# EAGLE design output_selector_v3 (EAGLE 7.5.0)
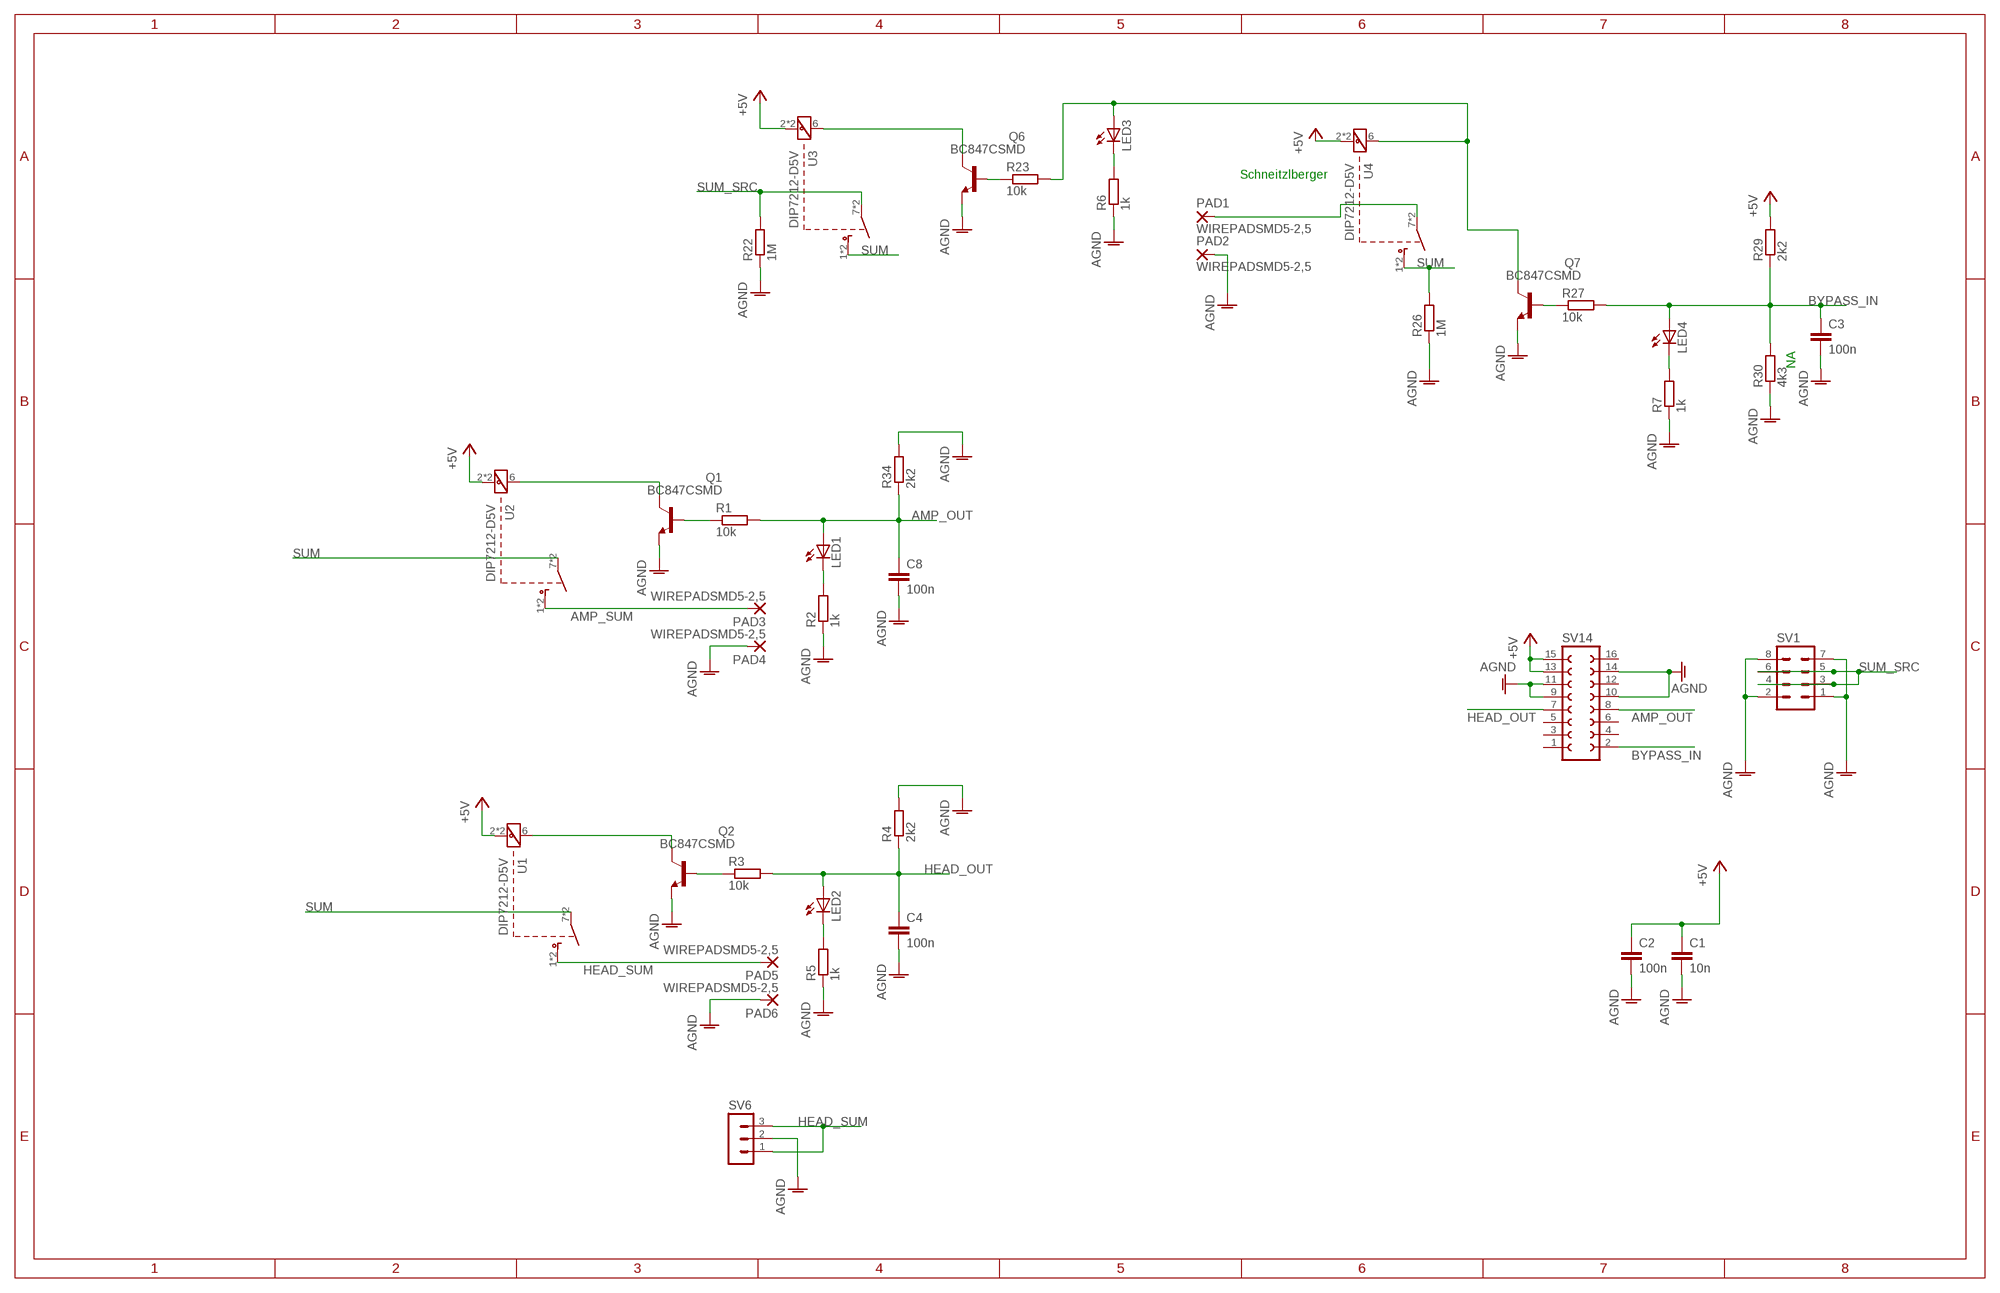
[diagram p0: schematic, sheet 1]

## Parts
C1  10n  C-EUC0603  [C0603]
C2  100n  C-EUC0603  [C0603]
C3  100n  C-EUC0603  [C0603]
C4  100n  C-EUC0603  [C0603]
C8  100n  C-EUC0603  [C0603]
LED1  LEDCHIPLED_0603  [CHIPLED_0603]
LED2  LEDCHIPLED_0603  [CHIPLED_0603]
LED3  LEDCHIPLED_0603  [CHIPLED_0603]
LED4  LEDCHIPLED_0603  [CHIPLED_0603]
PAD1  WIREPADSMD5-2,5  [5-2,5]
PAD2  WIREPADSMD5-2,5  [5-2,5]
PAD3  WIREPADSMD5-2,5  [5-2,5]
PAD4  WIREPADSMD5-2,5  [5-2,5]
PAD5  WIREPADSMD5-2,5  [5-2,5]
PAD6  WIREPADSMD5-2,5  [5-2,5]
Q1  BC847CSMD  [SOT23]
Q2  BC847CSMD  [SOT23]
Q6  BC847CSMD  [SOT23]
Q7  BC847CSMD  [SOT23]
R1  10k  R-EU_R0603  [R0603]
R2  1k  R-EU_R0603  [R0603]
R3  10k  R-EU_R0603  [R0603]
R4  2k2  R-EU_R0603  [R0603]
R5  1k  R-EU_R0603  [R0603]
R6  1k  R-EU_R0603  [R0603]
R7  1k  R-EU_R0603  [R0603]
R22  1M  R-EU_R0603  [R0603]
R23  10k  R-EU_R0603  [R0603]
R26  1M  R-EU_R0603  [R0603]
R27  10k  R-EU_R0603  [R0603]
R29  2k2  R-EU_R0603  [R0603]
R30  4k3  R-EU_R0603  [R0603]
R34  2k2  R-EU_R0603  [R0603]
SV1  MA04-2W  [MA04-2W]
SV6  MA03-1  [MA03-1]
SV14  FE08-2W  [FE08-2W]
U1  DIP7212-D5V  [DP-07]
U2  DIP7212-D5V  [DP-07]
U3  DIP7212-D5V  [DP-07]
U4  DIP7212-D5V  [DP-07]

## Nets
+5V: C1.1 C2.1 R29.2 SV14.13 SV14.15 U1.2 U1.13 U2.2 U2.13 U3.2 U3.13 U4.2 U4.13
AGND: C1.2 C2.2 C3.2 C4.2 C8.2 PAD2.1(P) PAD4.1(P) PAD6.1(P) Q1.2(E) Q2.2(E) Q6.2(E) Q7.2(E) R2.1 R4.2 R5.1 R6.1 R7.1 R22.1 R26.1 R30.1 R34.2 SV1.1 SV1.2 SV1.7 SV1.8 SV6.2 SV14.9 SV14.10 SV14.11 SV14.14
AMP_OUT: C8.1 LED1.A R1.2 R34.1 SV14.8
AMP_SUM: PAD3.1(P) U2.1 U2.14
BYPASS_IN: C3.1 LED4.A R27.2 R29.1 R30.2 SV14.2
HEAD_OUT: C4.1 LED2.A R3.2 R4.1 SV14.7
HEAD_SUM: PAD5.1(P) SV6.1 SV6.3 U1.1 U1.14
N$1: LED3.A Q7.3(C) R23.2 U4.6
N$2: Q1.3(C) U2.6
N$3: Q1.1(B) R1.1
N$4: Q2.3(C) U1.6
N$5: Q2.1(B) R3.1
N$6: LED1.C R2.2
N$7: LED2.C R5.2
N$8: LED3.C R6.2
N$9: LED4.C R7.2
N$23: Q6.1(B) R23.1
N$24: Q6.3(C) U3.6
N$25: PAD1.1(P) U4.7 U4.8
N$27: Q7.1(B) R27.1
SUM: R26.2 U1.7 U1.8 U2.7 U2.8 U3.1 U3.14 U4.1 U4.14
SUM_SRC: R22.2 SV1.3 SV1.4 SV1.5 SV1.6 U3.7 U3.8
Unconnected: SV14.1 SV14.3 SV14.4 SV14.5 SV14.6 SV14.12 SV14.16

## Notes on the sheet
- Schneitzlberger
- NA

## Library data of the parts
C1-C4 C8 = rcl:C-EU: CAPACITOR, European symbol
LED1-LED4 = led:LED: LED OSRAM: - CHIPLED LG R971, LG N971, LY N971, LG Q971, LY Q971, LO R971, LY R971 LH N974, LH R974 LS Q976, LO Q976, LY Q976 LO Q996 - Hyper CHIPLED LW Q18S LB Q993, LB Q99A, LB R99A - SideLED LS A670, LO A670, LY A670, LG A670, LP A670 LB A673, LV A673, LT A673, LW A673 LH A674 LY A675 LS A676, LA A676, LO A676, LY A676, LW A676 LS A679, LY A679, LG A679 - Hyper Micro SIDELED® LS Y876, LA Y876, LO Y876, LY Y876 LT Y87S - SmartLED LW L88C, LW L88S LB L89C, LB L89S, LG L890 LS L89K, LO L89K, LY L89K LS L896, LA L896, LO L896, LY L896 - TOPLED LS T670, LO T670, LY T670, LG T670, LP T670 LSG T670, LSP T670, LSY T670, LOP T670, LYG T670 LG T671, LOG T671, LSG T671 LB T673, LV T673, LT T673, LW T673 LH T674 LS T676, LA T676, LO T676, LY T676, LB T676, LH T676, LSB T676, LW T676 LB T67C, LV T67C, LT T67C, LS T67K, LO T67K, LY T67K, LW E67C LS E67B, LA E67B, LO E67B, LY E67B, LB E67C, LV E67C, LT E67C LW T67C LS T679, LY T679, LG T679 LS T770, LO T770, LY T770, LG T770, LP T770 LB T773, LV T773, LT T773, LW T773 LH T774 LS E675, LA E675, LY E675, LS T675 LS T776, LA T776, LO T776, LY T776, LB T776 LHGB T686 LT T68C, LB T68C - Hyper Mini TOPLED® LB M676 - Mini TOPLED Santana® LG M470 LS M47K, LO M47K, LY M47K Source: http://www.osram.convergy.de LUXEON: - LUMILED® LXK2-PW12-R00, LXK2-PW12-S00, LXK2-PW14-U00, LXK2-PW14-V00 LXK2-PM12-R00, LXK2-PM12-S00, LXK2-PM14-U00 LXK2-PE12-Q00, LXK2-PE12-R00, LXK2-PE12-S00, LXK2-PE14-T00, LXK2-PE14-U00 LXK2-PB12-K00, LXK2-PB12-L00, LXK2-PB12-M00, LXK2-PB14-N00, LXK2-PB14-P00, LXK2-PB14-Q00 LXK2-PR12-L00, LXK2-PR12-M00, LXK2-PR14-Q00, LXK2-PR14-R00 LXK2-PD12-Q00, LXK2-PD12-R00, LXK2-PD12-S00 LXK2-PH12-R00, LXK2-PH12-S00 LXK2-PL12-P00, LXK2-PL12-Q00, LXK2-PL12-R00 Source: www.luxeon.com KINGBRIGHT: KA-3528ASYC Source: www.kingbright.com
PAD1-PAD6 = wirepad:WIREPAD: Wire PAD connect wire on PCB
Q1 Q2 Q6 Q7 = transistor-npn:BC847*: NPN Transistor
R1-R7 R22 R23 R26 R27 R29 R30 R34 = rcl:R-EU_: RESISTOR, European symbol
SV1 = con-lstb:MA04-2W
SV6 = con-lstb:MA03-1: PIN HEADER; OC_FARNELL: unknown; OC_NEWARK: unknown
SV14 = con-lsta:FE08-2W: FEMALE HEADER; OC_FARNELL: unknown; OC_NEWARK: unknown
U1-U4 = meder:DIP7212-D5V: Meder DIP 7212-D 5V Reedrelais, 5V, 1 Schließer mit Diode, 1A http://cdn-reichelt.de/documents/datenblatt/C300/DATASHEET_DIP_NEW.pdf

## Board
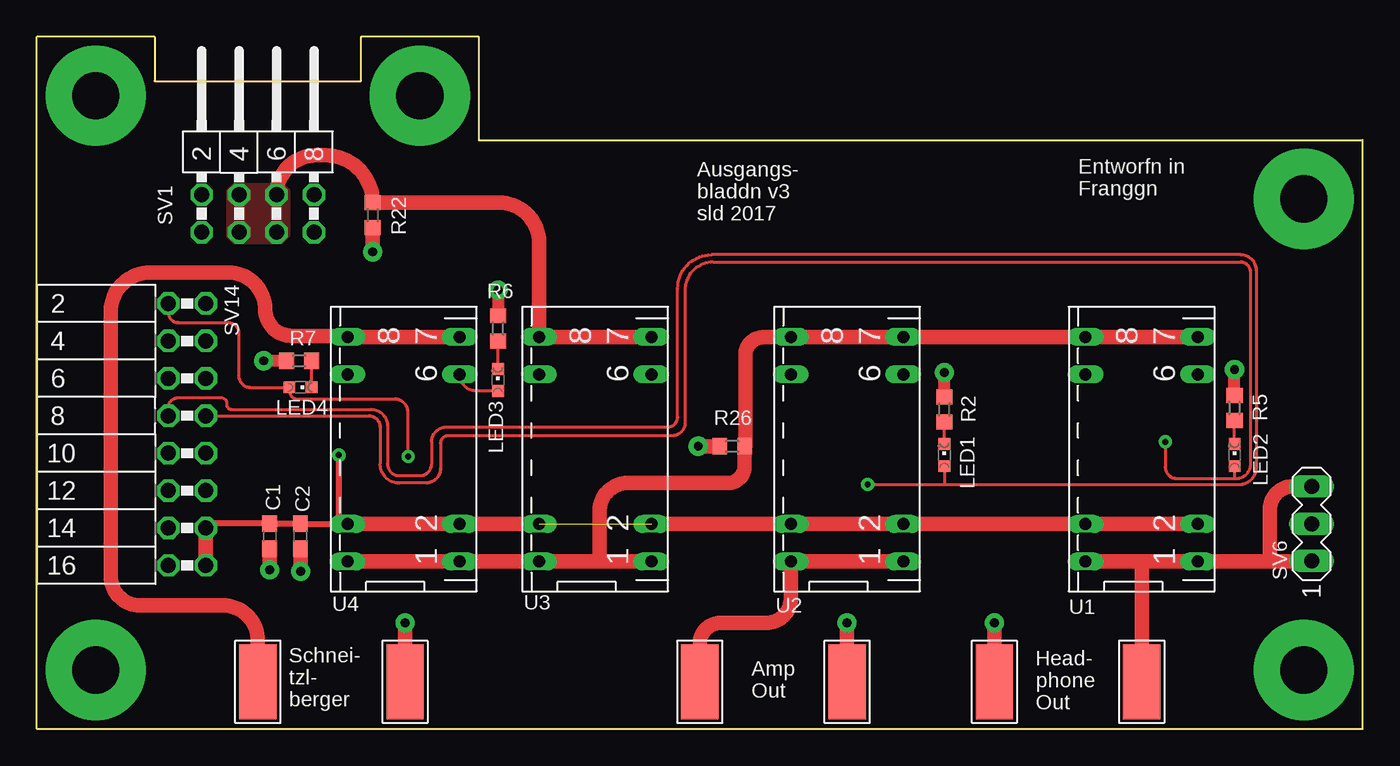
[diagram p1: board, top side]
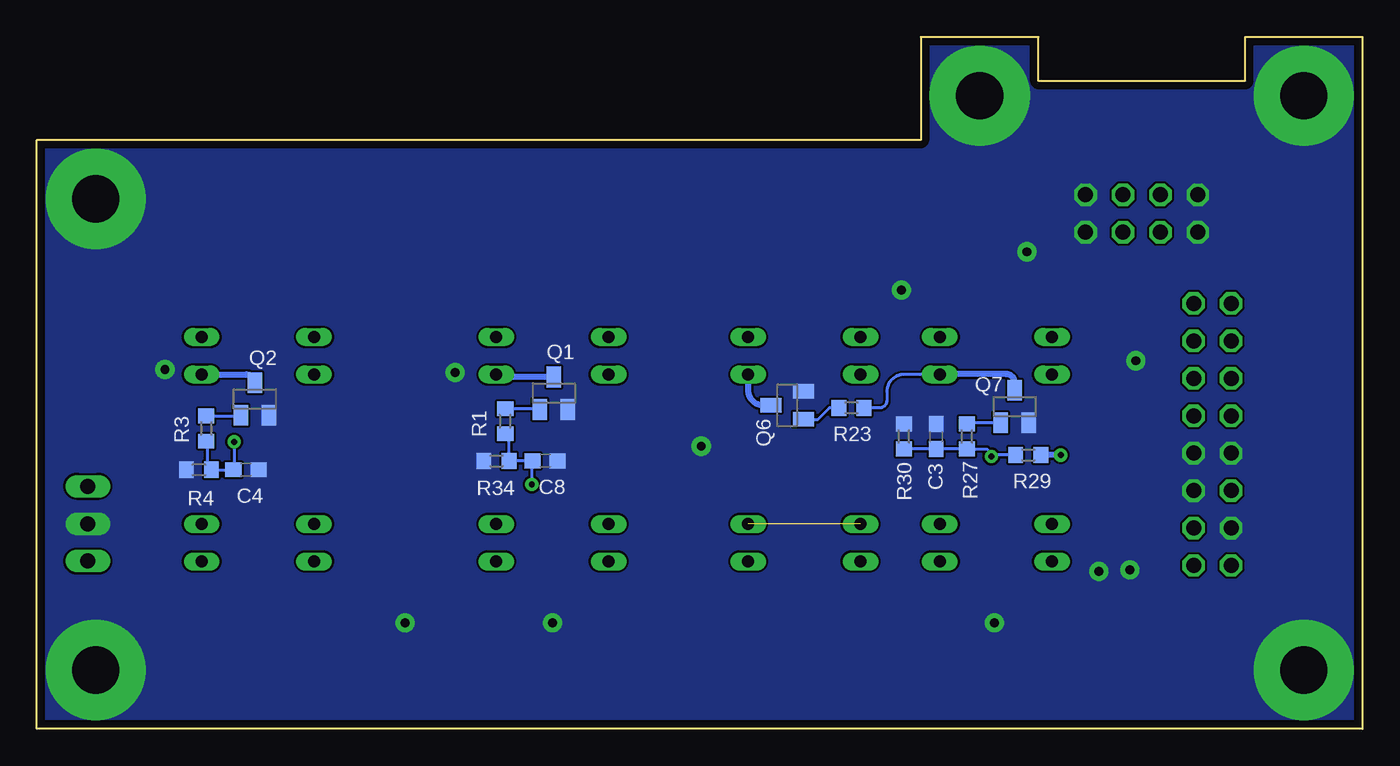
[diagram p2: board, bottom side, seen from below]

Size 90 x 47 mm. Coordinates in mm from the lower left corner, seen from the top.
Outline: 0,0 90,0 90,40 30,40 30,47 22,47 22,44 8,44 8,47 0,47 0,0
Copper layers (1*16): Top 0.035mm / dielectric 1.6mm / Bottom 0.035mm
Design rules "Elecrow_2-layer_PCB_eagle_rule": minimum track width 6mil, minimum drill 12mil, track to track 6mil, track to pad 8mil, pad to pad 12mil, via to via 12mil, smd to smd 0mil, copper to edge 20mil, drill to drill 10mil, minimum pad ring 6mil, minimum via ring 6mil, stop-mask expansion 0mil, vias tented up to drill 100mil, thermal gap 10mil

### Footprints (pad centres in the part's own frame; a part is rotated, then mirrored left to right if it is on the bottom)
C0603 = smd 1.1 x 1: 1 -0.85,0; 2 0.85,0
CHIPLED_0603 = smd 0.8 x 0.8: A 0,-0.75; C 0,0.75
5-2,5 = smd 2.54 x 5.08: 1 0,0
SOT23 = smd 1 x 1.4: 1 -0.95,-1.1; 2 0.95,-1.1; 3 0,1.1
R0603 = smd 1 x 1.1: 1 -0.85,0; 2 0.85,0
MA04-2W = drill 1.016 octagon: 1 -3.81,-1.27; 2 -3.81,1.27; 3 -1.27,-1.27; 4 -1.27,1.27; 5 1.27,-1.27; 6 1.27,1.27; 7 3.81,-1.27; 8 3.81,1.27
MA03-1 = drill 1.016 long: 1 -2.54,0; 2 0,0; 3 2.54,0
FE08-2W = drill 1.016 octagon: 1 -8.89,1.27; 2 -8.89,-1.27; 3 -6.35,1.27; 4 -6.35,-1.27; 5 -3.81,1.27; 6 -3.81,-1.27; 7 -1.27,1.27; 8 -1.27,-1.27; 9 1.27,1.27; 10 1.27,-1.27; 11 3.81,1.27; 12 3.81,-1.27; 13 6.35,1.27; 14 6.35,-1.27; 15 8.89,1.27; 16 8.89,-1.27
DP-07 = drill 0.813 long: 1 -7.62,-3.81; 2 -5.08,-3.81; 6 5.08,-3.81; 7 7.62,-3.81; 8 7.62,3.81; 9 5.08,3.81; 13 -5.08,3.81; 14 -7.62,3.81

### Placement (x,y rotation side)
C1  15.8,13.1 270 top
C2  17.9,13.1 270 top
C3  28.96,19.86 90 bottom
C4  75.8,17.6 0 bottom
C8  55.5,18.2 0 bottom
LED1  61.6,18.6 0 top
LED2  81.3,18.6 0 top
LED3  31.3,23.7 0 top
LED4  17.9,23.2 270 top
PAD1  15,3.2 0 top
PAD2  25,3.2 0 top
PAD3  45,3.2 0 top
PAD4  55,3.2 0 top
PAD5  75,3.2 0 top
PAD6  65,3.2 0 top
Q1  54.9,22.8 0 bottom
Q2  75.2,22.4 0 bottom
Q6  39.06,21.98 90 bottom
Q7  23.62,21.89 0 bottom
R1  58.2,20.9 270 bottom
R2  61.6,21.7 270 top
R3  78.5,20.4 270 bottom
R4  79,17.6 180 bottom
R5  81.3,21.8 270 top
R6  31.3,27.2 270 top
R7  17.8,25 0 top
R22  22.8,34.9 90 top
R23  34.7,21.8 0 bottom
R26  47.2,19.2 0 top
R27  26.87,19.86 270 bottom
R29  22.7,18.6 0 bottom
R30  31.14,19.86 270 bottom
R34  58.8,18.2 180 bottom
SV1  15,35 0 top
SV6  86.53,13.94 90 top
SV14  10.2,20 270 top
U1  75,19 90 top
U2  55,19 90 top
U3  37.9,19 90 top
U4  24.9,19 90 top

### Tracks (layer width: path | path; a pad name or v marks a point on that pad's centre or on a via)
+5V  (via drill 0.4 pad 0.9)  (1 unrouted)
  Top 0.4: C2.1 C1.1 11.77,13.95 arc90 SV14.13 | 17.93,13.92 U4.13 arc-90 20.5,14.51 v20.5,18.6
  Top 0.6: C2.1 arc90 17.93,13.92
  Top 1: U1.2 U1.13 U2.2 U2.13 U3.2 | U4.13 U4.2 U3.13 | SV14.15 SV14.13
  Bottom 0.4: v20.5,18.6 R29.2
AGND  (via drill 0.6 pad 1.3, 3.2 pad 6.8)
  Top 0.8: R7.1 v15.4,25 | v31.3,29.8 R6.1 | R2.1 v61.6,24.2 | R5.1 v81.3,24.4
  Top 1: R22.1 v22.8,32.4 | C1.2 v15.8,10.8 | C2.2 v17.9,10.7 | v44.9,19.2 R26.1 | PAD4.1 v55,7.2 | PAD6.1 v65,7.2 | PAD2.1 v25,7.2
  other vias: 4,43 86,36 86,4 4,4 26,43
  pour Bottom (no thermals): 0,0 0,47 8,47 8,44 22,44 22,47 30,47 30,40 90,40 90,0
AMP_OUT  (via drill 0.4 pad 0.9)
  Top 0.2: v56.4,16.6 61.6,16.6 | 61.6,16.6 81.6,16.6 arc90 82.8,17.8 82.8,31.1 arc90 81.7,32.2 45.8,32.2 arc90 43.5,29.9 43.5,21.2 arc-90 42.8,20.5 27.8,20.5 arc90 26.8,19.5 26.8,18 arc-90 26,17.2 24.6,17.2 arc-90 23.8,18 23.8,20.6 arc90 22.7,21.7 13.2,21.7 arc-90 12.9,22 12.9,22.1 arc90 12.5,22.5 9.6,22.5 arc90 8.93,21.83 SV14.8 | LED1.A 61.6,16.6
  Bottom 0.2: R1.2 arc90 57.95,19.8 R34.1 C8.1 arc-90 56.4,18.15 v56.4,16.6
AMP_SUM
  Top 1: 51.17,11.4 arc-90 U2.14 | U2.14 U2.1 | PAD3.1 45,5.8 arc-90 46.4,7.2 49.5,7.2 arc90 51.2,8.9 U2.14 arc90 U2.14
BYPASS_IN  (via drill 0.4 pad 0.9)
  Top 0.2: v25.2,18.5 25.2,21.5 arc90 24.3,22.4 17.7,22.4 arc-90 17.15,22.95 LED4.A 14.5,23.2 arc-90 13.7,24 13.7,26.9 arc90 13,27.6 9.6,27.6 arc-90 8.93,28.27 SV14.2
  Bottom 0.2: 26.89,19.01 C3.1 R30.2 | R27.2 25.49,19.01 25.2,18.72 v25.2,18.5 25.1,18.6 R29.1
  Bottom 0.4: R27.2 26.89,19.01 arc-90 26.9,19
HEAD_OUT  (via drill 0.4 pad 0.9)
  Top 0.2: SV14.7 22.53,21.27 arc-90 23.3,20.5 23.3,18 arc90 24.6,16.7 26.4,16.7 arc90 27.4,17.7 27.4,19.4 arc-90 27.9,19.9 43.1,19.9 arc90 44,20.8 44,29.8 arc-90 45.9,31.7 81.7,31.7 arc-90 82.4,31 82.4,18 arc-90 81.4,17 | v76.6,19.5 76.6,17.8 arc90 77.4,17 81.4,17 | LED2.A 81.3,17.1 arc90 81.4,17
  Bottom 0.2: R3.2 arc90 78.45,19.5 78.45,17.9 arc-90 R4.1 C4.1 arc90 76.6,17.55 v76.6,19.5
HEAD_SUM
  Top 1: 74.7,11.38 U1.1 83.9,11.38 | 74.7,11.38 U1.14 arc90 71.17,11.4 | PAD5.1 75,11.08 arc90 74.7,11.38 | 83.9,11.38 86.51,11.38 SV6.1 | SV6.3 85.28,16.48 arc90 83.7,14.9 83.7,11.58 arc90 83.9,11.38
N$1
  Top 0.2: LED3.A 29.84,22.95 arc-90 U4.6
  Bottom 0.2: U4.6 31.12,24.08 arc-90 32.3,22.9 32.3,22.3 arc90 32.8,21.8 R23.2
  Bottom 0.4: Q7.3 23.62,23.52 arc-90 24.2,24.1 28.69,24.1 arc-90 U4.6
N$2
  Bottom 0.4: Q1.3 58.63,23.9 arc90 U2.6
N$3
  Bottom 0.2: R1.1 55.9,21.75 arc90 Q1.1
N$4
  Bottom 0.4: U1.6 75.78,24.08 arc90 Q2.3
N$5
  Bottom 0.2: R3.1 76.2,21.25 arc-90 Q2.1
N$6
  Top 0.2: LED1.C R2.2
N$7
  Top 0.2: LED2.C R5.2
N$8
  Top 0.2: LED3.C R6.2
N$9
  Top 0.2: LED4.C R7.2
N$23
  Bottom 0.2: R23.1 36.2,21.8 37,21 37.94,21 Q6.1
N$24
  Bottom 0.4: Q6.3 40.68,21.98 arc90 41.7,23 U3.6 arc-90 U3.6
N$25
  Top 1: PAD1.1 15,6 arc90 12.6,8.4 7,8.4 arc-90 5,10.4 5,28.3 arc-90 7.7,31 13,31 arc-90 15.5,28.5 arc90 17.3,26.7 21.01,26.7 | U4.7 U4.8 | 21.01,26.7 arc-90 U4.8 | 21.01,26.7 arc-90 U4.8
N$27
  Bottom 0.2: Q7.1 26.79,20.79
  Bottom 0.4: 26.79,20.79 arc-90 R27.1
SUM
  Top 1: U4.14 U4.1 U3.14 37.9,11.38 | 37.9,11.38 U3.1 | U1.7 U1.8 U2.7 U2.8 arc-90 51.17,26.6 49.3,26.6 arc90 48.1,25.4 48.1,19.25 arc-90 R26.2 48.05,17.85 arc-90 46.9,16.7 40.1,16.7 arc90 38.2,14.8 38.2,11.68 arc-90 37.9,11.38
SUM_SRC
  Top 1: U3.8 U3.7 | U3.8 arc-90 U3.8 | SV1.6 arc-90 18.95,38.95 19.6,38.95 arc-90 R22.2 31.35,35.75 arc-90 34.1,33 U3.8 | U3.8 arc-90 U3.8
  pour Top (no thermals): 13,36.6 13.4,37 16.7,37 17.1,36.6 17.1,33.5 16.6,33 13.4,33 13,33.4

### Text on the board
tNames: Entworfn in / Franggn | Ausgangs- / bladdn v3 / sld 2017 | Schnei- / tzl- / berger | Amp / Out | Head- / phone / Out